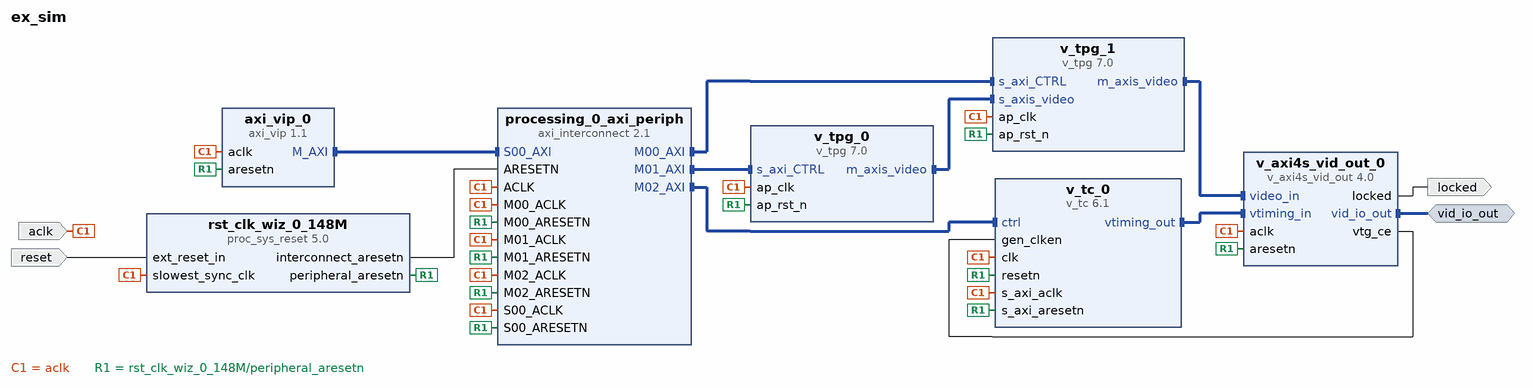
[diagram p0: block diagram of the top level]
# Vivado block design ex_sim, xc7a35tcpg236-1, Vivado 2017.4
create_bd_design ex_sim

create_bd_intf_port -mode Master -vlnv xilinx.com:interface:vid_io_rtl:1.0 vid_io_out
create_bd_port -dir I -type clk aclk
set_property -dict [list \
  CONFIG.FREQ_HZ 300000000 \
  CONFIG.PHASE 0.0 \
  CONFIG.CLK_DOMAIN design_sim_clk_wiz_0_0_clk_out1 \
] [get_bd_ports aclk]
create_bd_port -dir O locked
create_bd_port -dir I -type rst reset
set_property -dict {CONFIG.POLARITY ACTIVE_HIGH} [get_bd_ports reset]

create_bd_cell -type ip -vlnv xilinx.com:ip:axi_vip:1.1 axi_vip_0
set_property -dict [list \
  CONFIG.PROTOCOL AXI4LITE \
  CONFIG.READ_WRITE_MODE WRITE_ONLY \
  CONFIG.INTERFACE_MODE MASTER \
  CONFIG.ADDR_WIDTH 32 \
  CONFIG.DATA_WIDTH 32 \
  CONFIG.HAS_PROT 1 \
  CONFIG.HAS_WSTRB 1 \
  CONFIG.HAS_BRESP 1 \
] [get_bd_cells axi_vip_0]
create_bd_cell -type ip -vlnv xilinx.com:ip:axi_interconnect:2.1 processing_0_axi_periph
set_property -dict {CONFIG.NUM_MI 3} [get_bd_cells processing_0_axi_periph]
create_bd_cell -type ip -vlnv xilinx.com:ip:proc_sys_reset:5.0 rst_clk_wiz_0_148M
set_property -dict {CONFIG.USE_BOARD_FLOW true CONFIG.RESET_BOARD_INTERFACE Custom} [get_bd_cells rst_clk_wiz_0_148M]
create_bd_cell -type ip -vlnv xilinx.com:ip:v_axi4s_vid_out:4.0 v_axi4s_vid_out_0
set_property -dict [list \
  CONFIG.C_PIXELS_PER_CLOCK 1 \
  CONFIG.C_S_AXIS_VIDEO_FORMAT 2 \
  CONFIG.C_S_AXIS_VIDEO_DATA_WIDTH 8 \
  CONFIG.C_NATIVE_COMPONENT_WIDTH 8 \
  CONFIG.C_HAS_ASYNC_CLK 0 \
  CONFIG.C_ADDR_WIDTH 5 \
  CONFIG.C_HYSTERESIS_LEVEL 8 \
  CONFIG.C_VTG_MASTER_SLAVE 0 \
] [get_bd_cells v_axi4s_vid_out_0]
create_bd_cell -type ip -vlnv xilinx.com:ip:v_tpg:7.0 v_tpg_1
set_property -dict [list \
  CONFIG.SAMPLES_PER_CLOCK 1 \
  CONFIG.MAX_COLS 4096 \
  CONFIG.MAX_ROWS 2160 \
  CONFIG.MAX_DATA_WIDTH 8 \
  CONFIG.NUM_VIDEO_COMPONENTS 3 \
  CONFIG.HAS_AXI4S_SLAVE 1 \
  CONFIG.SOLID_COLOR 1 \
  CONFIG.RAMP 1 \
  CONFIG.COLOR_BAR 1 \
  CONFIG.DISPLAY_PORT 1 \
  CONFIG.COLOR_SWEEP 1 \
  CONFIG.ZONE_PLATE 1 \
  CONFIG.FOREGROUND 1 \
] [get_bd_cells v_tpg_1]
create_bd_cell -type ip -vlnv xilinx.com:ip:v_tc:6.1 v_tc_0
set_property -dict [list \
  CONFIG.HAS_AXI4_LITE true \
  CONFIG.VIDEO_MODE Custom \
  CONFIG.GEN_F0_VSYNC_VSTART 7 \
  CONFIG.GEN_HACTIVE_SIZE 10 \
  CONFIG.GEN_HSYNC_END 12 \
  CONFIG.GEN_HFRAME_SIZE 14 \
  CONFIG.GEN_F0_VSYNC_HSTART 10 \
  CONFIG.GEN_F0_VSYNC_HEND 10 \
  CONFIG.GEN_F0_VFRAME_SIZE 10 \
  CONFIG.GEN_F0_VSYNC_VEND 8 \
  CONFIG.GEN_F0_VBLANK_HEND 10 \
  CONFIG.GEN_HSYNC_START 11 \
  CONFIG.GEN_VACTIVE_SIZE 6 \
  CONFIG.GEN_F0_VBLANK_HSTART 10 \
  CONFIG.enable_detection false \
] [get_bd_cells v_tc_0]
create_bd_cell -type ip -vlnv xilinx.com:ip:v_tpg:7.0 v_tpg_0
set_property -dict [list \
  CONFIG.SAMPLES_PER_CLOCK 1 \
  CONFIG.MAX_COLS 4096 \
  CONFIG.MAX_ROWS 2160 \
  CONFIG.MAX_DATA_WIDTH 8 \
  CONFIG.NUM_VIDEO_COMPONENTS 3 \
  CONFIG.HAS_AXI4S_SLAVE 0 \
  CONFIG.SOLID_COLOR 1 \
  CONFIG.RAMP 1 \
  CONFIG.COLOR_BAR 1 \
  CONFIG.DISPLAY_PORT 1 \
  CONFIG.COLOR_SWEEP 1 \
  CONFIG.ZONE_PLATE 1 \
  CONFIG.FOREGROUND 1 \
] [get_bd_cells v_tpg_0]

# ---- connections ----

connect_bd_intf_net [get_bd_intf_pins axi_vip_0/M_AXI] [get_bd_intf_pins processing_0_axi_periph/S00_AXI]
connect_bd_intf_net [get_bd_intf_pins processing_0_axi_periph/M00_AXI] [get_bd_intf_pins v_tpg_1/s_axi_CTRL]
connect_bd_intf_net [get_bd_intf_pins processing_0_axi_periph/M01_AXI] [get_bd_intf_pins v_tpg_0/s_axi_CTRL]
connect_bd_intf_net [get_bd_intf_pins processing_0_axi_periph/M02_AXI] [get_bd_intf_pins v_tc_0/ctrl]
connect_bd_intf_net [get_bd_intf_pins v_axi4s_vid_out_0/video_in] [get_bd_intf_pins v_tpg_1/m_axis_video]
connect_bd_intf_net [get_bd_intf_pins v_axi4s_vid_out_0/vtiming_in] [get_bd_intf_pins v_tc_0/vtiming_out]
connect_bd_intf_net [get_bd_intf_pins v_tpg_1/s_axis_video] [get_bd_intf_pins v_tpg_0/m_axis_video]
connect_bd_intf_net [get_bd_intf_ports vid_io_out] [get_bd_intf_pins v_axi4s_vid_out_0/vid_io_out]
connect_bd_net [get_bd_ports aclk] \
  [get_bd_pins axi_vip_0/aclk] [get_bd_pins processing_0_axi_periph/ACLK] [get_bd_pins processing_0_axi_periph/M00_ACLK] \
  [get_bd_pins processing_0_axi_periph/M01_ACLK] [get_bd_pins processing_0_axi_periph/M02_ACLK] \
  [get_bd_pins processing_0_axi_periph/S00_ACLK] [get_bd_pins rst_clk_wiz_0_148M/slowest_sync_clk] \
  [get_bd_pins v_axi4s_vid_out_0/aclk] [get_bd_pins v_tpg_1/ap_clk] [get_bd_pins v_tc_0/clk] [get_bd_pins v_tc_0/s_axi_aclk] \
  [get_bd_pins v_tpg_0/ap_clk]
connect_bd_net [get_bd_ports reset] [get_bd_pins rst_clk_wiz_0_148M/ext_reset_in]
connect_bd_net [get_bd_pins rst_clk_wiz_0_148M/interconnect_aresetn] [get_bd_pins processing_0_axi_periph/ARESETN]
connect_bd_net [get_bd_pins rst_clk_wiz_0_148M/peripheral_aresetn] \
  [get_bd_pins axi_vip_0/aresetn] [get_bd_pins processing_0_axi_periph/M00_ARESETN] \
  [get_bd_pins processing_0_axi_periph/M01_ARESETN] [get_bd_pins processing_0_axi_periph/M02_ARESETN] \
  [get_bd_pins processing_0_axi_periph/S00_ARESETN] [get_bd_pins v_axi4s_vid_out_0/aresetn] [get_bd_pins v_tpg_1/ap_rst_n] \
  [get_bd_pins v_tc_0/resetn] [get_bd_pins v_tc_0/s_axi_aresetn] [get_bd_pins v_tpg_0/ap_rst_n]
connect_bd_net [get_bd_pins v_axi4s_vid_out_0/locked] [get_bd_ports locked]
connect_bd_net [get_bd_pins v_axi4s_vid_out_0/vtg_ce] [get_bd_pins v_tc_0/gen_clken]

# ---- address map ----
assign_bd_address -offset 0x44A00000 -range 64K -target_address_space [get_bd_addr_spaces axi_vip_0/Master_AXI] [get_bd_addr_segs v_tpg_0/s_axi_CTRL/Reg]
assign_bd_address -offset 0x44A10000 -range 64K -target_address_space [get_bd_addr_spaces axi_vip_0/Master_AXI] [get_bd_addr_segs v_tpg_1/s_axi_CTRL/Reg]
assign_bd_address -offset 0x44A40000 -range 64K -target_address_space [get_bd_addr_spaces axi_vip_0/Master_AXI] [get_bd_addr_segs v_tc_0/ctrl/Reg]

validate_bd_design
save_bd_design
